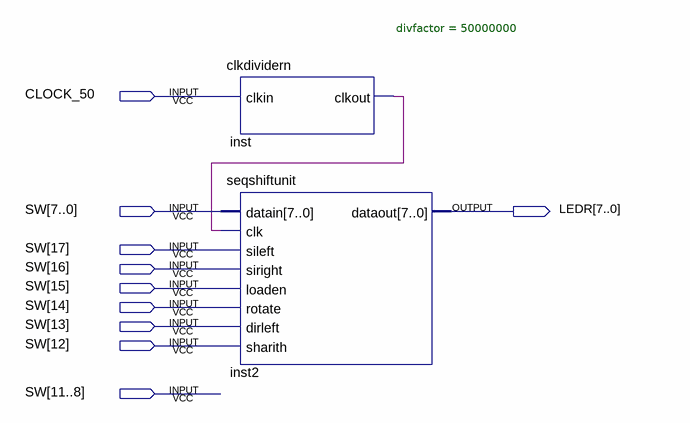
[diagram p0: schematic sheet]
// Quartus schematic SeqShiftUnit_Demo.bdf as structural Verilog: 2 symbols, 10 pins
module SeqShiftUnit_Demo (
  input  CLOCK_50,
  input  [17:0] SW,
  output [7:0] LEDR
);

  wire inst_clkout;

  clkdividern #(.divfactor(50000000)) inst (.clkin(CLOCK_50), .clkout(inst_clkout));
  seqshiftunit inst2 (
    .datain(SW[7:0]), .clk(inst_clkout), .sileft(SW[17]), .siright(SW[16]), .loaden(SW[15]), .rotate(SW[14]),
    .dirleft(SW[13]), .sharith(SW[12]), .dataout(LEDR));
endmodule
